# EAGLE schematic stm32-rs485-daughter (EAGLE 6.5.0)
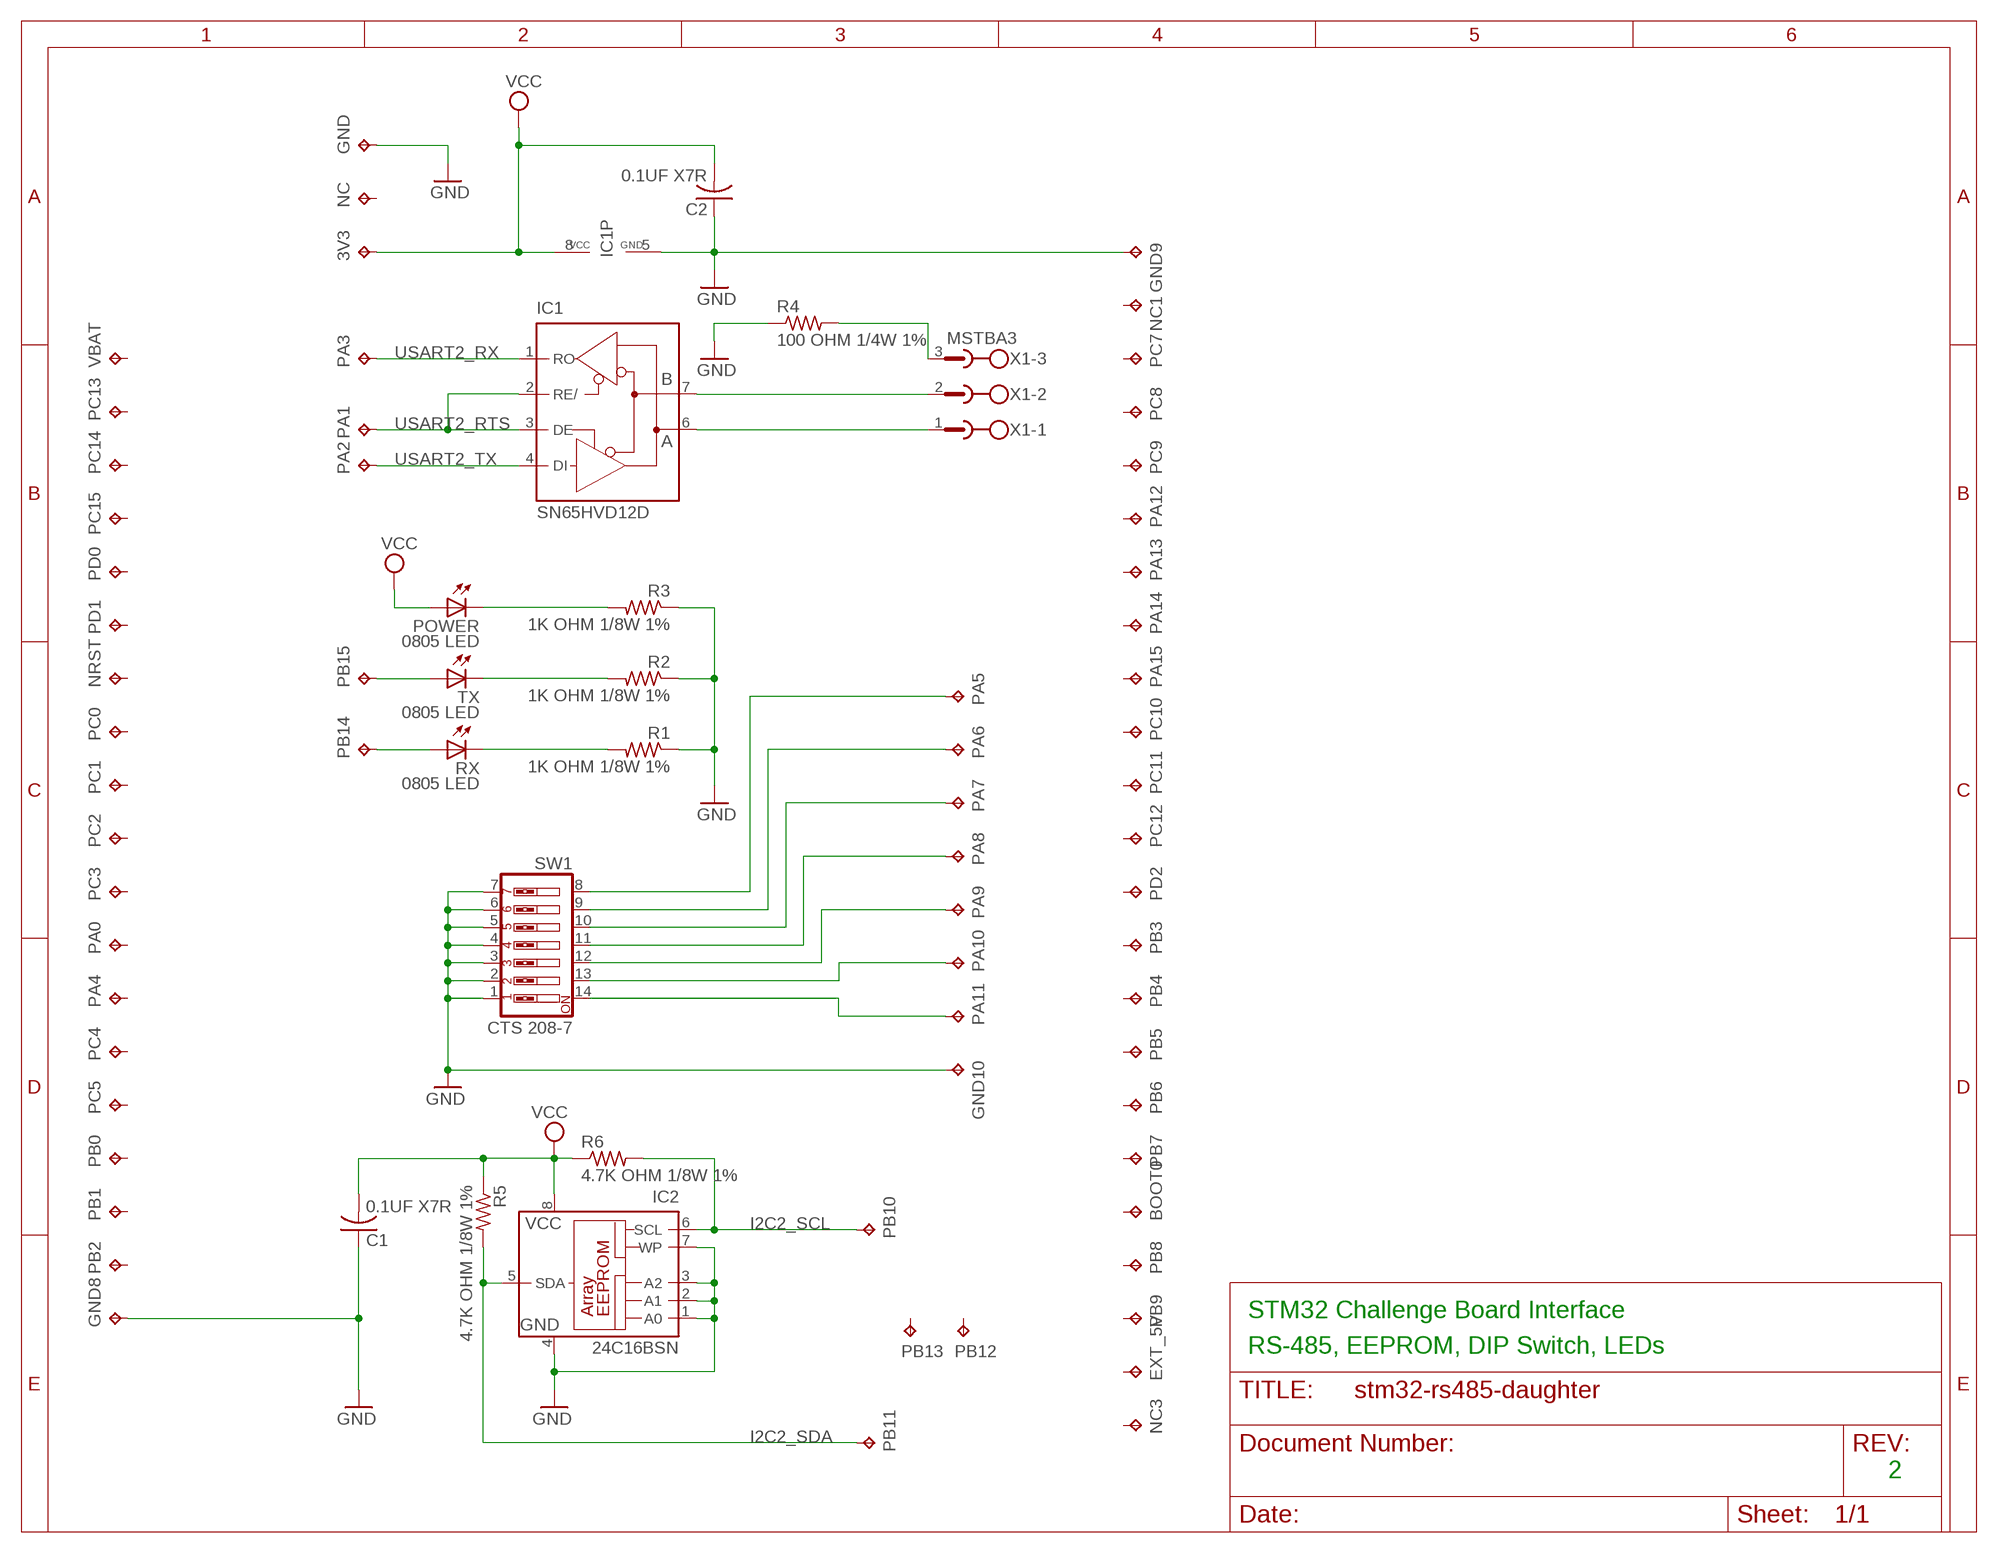
[diagram p0: schematic, sheet 1]

## Parts
3V3  TPPAD1-13  [P1-13]
BOOT0  TPPAD1-13  [P1-13]
C1  0.1UF X7R  C-USC0805  [C0805]
C2  0.1UF X7R  C-USC0805  [C0805]
EXT_5V  TPPAD1-13  [P1-13]
GND  TPPAD1-13  [P1-13]
GND8  TPPAD1-13  [P1-13]
GND9  TPPAD1-13  [P1-13]
GND10  TPPAD1-13  [P1-13]
IC1  SN65HVD12D  MAX481CSA  [SO08]
IC2  24C16BSN  [SO-08]
NC  TPPAD1-13  [P1-13]
NC1  TPPAD1-13  [P1-13]
NC3  TPPAD1-13  [P1-13]
NRST  TPPAD1-13  [P1-13]
PA0  TPPAD1-13  [P1-13]
PA1  TPPAD1-13  [P1-13]
PA2  TPPAD1-13  [P1-13]
PA3  TPPAD1-13  [P1-13]
PA4  TPPAD1-13  [P1-13]
PA5  TPPAD1-13  [P1-13]
PA6  TPPAD1-13  [P1-13]
PA7  TPPAD1-13  [P1-13]
PA8  TPPAD1-13  [P1-13]
PA9  TPPAD1-13  [P1-13]
PA10  TPPAD1-13  [P1-13]
PA11  TPPAD1-13  [P1-13]
PA12  TPPAD1-13  [P1-13]
PA13  TPPAD1-13  [P1-13]
PA14  TPPAD1-13  [P1-13]
PA15  TPPAD1-13  [P1-13]
PB0  TPPAD1-13  [P1-13]
PB1  TPPAD1-13  [P1-13]
PB2  TPPAD1-13  [P1-13]
PB3  TPPAD1-13  [P1-13]
PB4  TPPAD1-13  [P1-13]
PB5  TPPAD1-13  [P1-13]
PB6  TPPAD1-13  [P1-13]
PB7  TPPAD1-13  [P1-13]
PB8  TPPAD1-13  [P1-13]
PB9  TPPAD1-13  [P1-13]
PB10  TPPAD1-13  [P1-13]
PB11  TPPAD1-13  [P1-13]
PB12  TPPAD1-13  [P1-13]
PB13  TPPAD1-13  [P1-13]
PB14  TPPAD1-13  [P1-13]
PB15  TPPAD1-13  [P1-13]
PC0  TPPAD1-13  [P1-13]
PC1  TPPAD1-13  [P1-13]
PC2  TPPAD1-13  [P1-13]
PC3  TPPAD1-13  [P1-13]
PC4  TPPAD1-13  [P1-13]
PC5  TPPAD1-13  [P1-13]
PC7  TPPAD1-13  [P1-13]
PC8  TPPAD1-13  [P1-13]
PC9  TPPAD1-13  [P1-13]
PC10  TPPAD1-13  [P1-13]
PC11  TPPAD1-13  [P1-13]
PC12  TPPAD1-13  [P1-13]
PC13  TPPAD1-13  [P1-13]
PC14  TPPAD1-13  [P1-13]
PC15  TPPAD1-13  [P1-13]
PD0  TPPAD1-13  [P1-13]
PD1  TPPAD1-13  [P1-13]
PD2  TPPAD1-13  [P1-13]
POWER  0805 LED  LEDCHIPLED_0805  [CHIPLED_0805]
R1  1K OHM 1/8W 1%  R-US_R0805  [R0805]
R2  1K OHM 1/8W 1%  R-US_R0805  [R0805]
R3  1K OHM 1/8W 1%  R-US_R0805  [R0805]
R4  100 OHM 1/4W 1%  R-US_R1206  [R1206]
R5  4.7K OHM 1/8W 1%  R-US_R0805  [R0805]
R6  4.7K OHM 1/8W 1%  R-US_R0805  [R0805]
RX  0805 LED  LEDCHIPLED_0805  [CHIPLED_0805]
SW1  CTS 208-7  SW_DIP-7  [EDG-07]
TX  0805 LED  LEDCHIPLED_0805  [CHIPLED_0805]
VBAT  TPPAD1-13  [P1-13]
X1  MSTBA3  [MSTBA3]

## Nets
GND: C1.1 C2.1 GND8.TP GND9.TP GND10.TP GND.TP IC1.5(GND) IC2.1(A0) IC2.2(A1) IC2.3(A2) IC2.4(GND) IC2.7(WP) R1.1 R2.1 R3.1 R4.1 SW1.1 SW1.2 SW1.3 SW1.4 SW1.5 SW1.6 SW1.7
I2C2_SCL: IC2.6(SCL) PB10.TP R6.2
I2C2_SDA: IC2.5(SDA) PB11.TP R5.2
N$1: IC1.7(B) X1.2
N$2: IC1.6(A) X1.1
N$3: R4.2 X1.3
N$5: POWER.C R3.2
N$6: R2.2 TX.C
N$7: R1.2 RX.C
N$11: PB15.TP TX.A
N$12: PB14.TP RX.A
N$13: PA5.TP SW1.8
N$14: PA6.TP SW1.9
N$15: PA7.TP SW1.10
N$16: PA8.TP SW1.11
N$17: PA9.TP SW1.12
N$18: PA10.TP SW1.13
N$19: PA11.TP SW1.14
USART2_RTS: IC1.2(RE/) IC1.3(DE) PA1.TP
USART2_RX: IC1.1(RO) PA3.TP
USART2_TX: IC1.4(DI) PA2.TP
VCC: 3V3.TP C1.2 C2.2 IC1.8(VCC) IC2.8(VCC) POWER.A R5.1 R6.1
Unconnected: BOOT0.TP EXT_5V.TP NC1.TP NC3.TP NC.TP NRST.TP PA0.TP PA4.TP PA12.TP PA13.TP PA14.TP PA15.TP PB0.TP PB1.TP PB2.TP PB3.TP PB4.TP PB5.TP PB6.TP PB7.TP PB8.TP PB9.TP PB12.TP PB13.TP PC0.TP PC1.TP PC2.TP PC3.TP PC4.TP PC5.TP PC7.TP PC8.TP PC9.TP PC10.TP PC11.TP PC12.TP PC13.TP PC14.TP PC15.TP PD0.TP PD1.TP PD2.TP VBAT.TP

## Notes on the sheet
- STM32 Challenge Board Interface
- RS-485, EEPROM, DIP Switch, LEDs
- 2

## Library data of the parts
3V3 BOOT0 EXT_5V GND GND8-GND10 NC NC1 NC3 NRST PA0 PA1-PA15 PB0 PB1-PB15 PC0 PC1-PC5 PC7-PC15 PD0 PD1 PD2 VBAT = testpad:TP: Test pad
C1 C2 = rcl:C-US: CAPACITOR, American symbol
IC1 = maxim:MAX481CSA: RS485 TRANSEIVER
IC2 = microchip:24*: Serial EEPROM I2C
POWER RX TX = led:LED: LED OSRAM: - CHIPLED LG R971, LG N971, LY N971, LG Q971, LY Q971, LO R971, LY R971 LH N974, LH R974 LS Q976, LO Q976, LY Q976 LO Q996 - Hyper CHIPLED LW Q18S LB Q993, LB Q99A, LB R99A - SideLED LS A670, LO A670, LY A670, LG A670, LP A670 LB A673, LV A673, LT A673, LW A673 LH A674 LY A675 LS A676, LA A676, LO A676, LY A676, LW A676 LS A679, LY A679, LG A679 - Hyper Micro SIDELED® LS Y876, LA Y876, LO Y876, LY Y876 LT Y87S - SmartLED LW L88C, LW L88S LB L89C, LB L89S, LG L890 LS L89K, LO L89K, LY L89K LS L896, LA L896, LO L896, LY L896 - TOPLED LS T670, LO T670, LY T670, LG T670, LP T670 LSG T670, LSP T670, LSY T670, LOP T670, LYG T670 LG T671, LOG T671, LSG T671 LB T673, LV T673, LT T673, LW T673 LH T674 LS T676, LA T676, LO T676, LY T676, LB T676, LH T676, LSB T676, LW T676 LB T67C, LV T67C, LT T67C, LS T67K, LO T67K, LY T67K, LW E67C LS E67B, LA E67B, LO E67B, LY E67B, LB E67C, LV E67C, LT E67C LW T67C LS T679, LY T679, LG T679 LS T770, LO T770, LY T770, LG T770, LP T770 LB T773, LV T773, LT T773, LW T773 LH T774 LS E675, LA E675, LY E675, LS T675 LS T776, LA T776, LO T776, LY T776, LB T776 LHGB T686 LT T68C, LB T68C - Hyper Mini TOPLED® LB M676 - Mini TOPLED Santana® LG M470 LS M47K, LO M47K, LY M47K Source: http://www.osram.convergy.de LUXEON: - LUMILED® LXK2-PW12-R00, LXK2-PW12-S00, LXK2-PW14-U00, LXK2-PW14-V00 LXK2-PM12-R00, LXK2-PM12-S00, LXK2-PM14-U00 LXK2-PE12-Q00, LXK2-PE12-R00, LXK2-PE12-S00, LXK2-PE14-T00, LXK2-PE14-U00 LXK2-PB12-K00, LXK2-PB12-L00, LXK2-PB12-M00, LXK2-PB14-N00, LXK2-PB14-P00, LXK2-PB14-Q00 LXK2-PR12-L00, LXK2-PR12-M00, LXK2-PR14-Q00, LXK2-PR14-R00 LXK2-PD12-Q00, LXK2-PD12-R00, LXK2-PD12-S00 LXK2-PH12-R00, LXK2-PH12-S00 LXK2-PL12-P00, LXK2-PL12-Q00, LXK2-PL12-R00 Source: www.luxeon.com KINGBRIGHT: KA-3528ASYC Source: www.kingbright.com
R1-R6 = rcl:R-US_: RESISTOR, American symbol
SW1 = special:SW_DIP-7: DIP SWITCH
X1 = con-phoenix-508:MSTBA3: PHOENIX